# Altium project copper_suicide.PrjPCB (part 5 of 5)
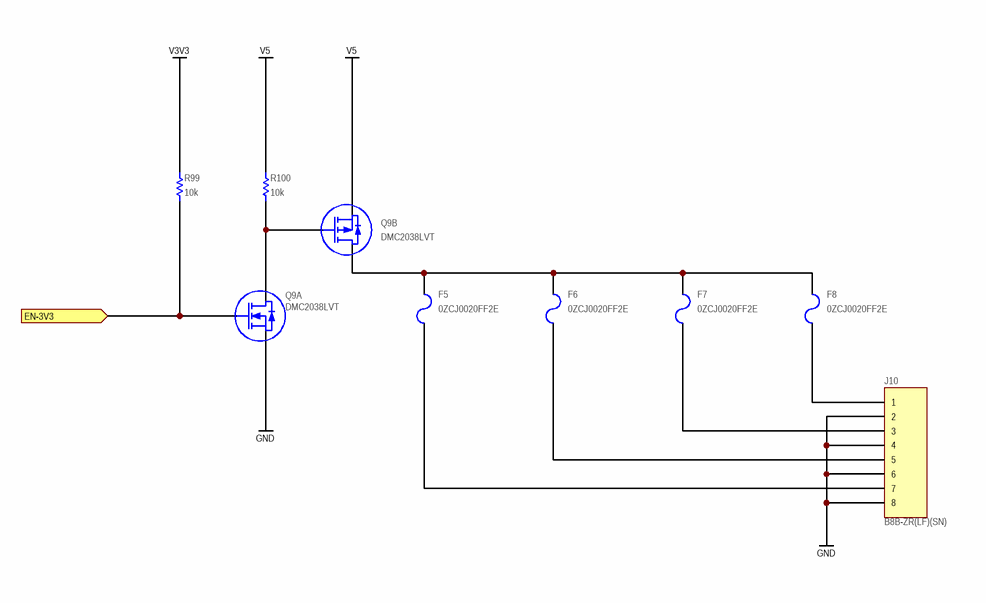
[diagram p22: fans.SchDoc]

## Nets that join several sheets
GND: array (J7.1 J7.4 J7.5), FPGA01 (46 pins), FPGA01/FPGAGND (226 pins), FPGA01/FPGASERDES (41 pins), FPGA01/FPGAPOWER (34 pins), FPGA02 (46 pins), FPGA02/FPGAGND (226 pins), FPGA02/FPGASERDES (41 pins), FPGA02/FPGAPOWER (34 pins), FPGA03 (46 pins), FPGA03/FPGAGND (226 pins), FPGA03/FPGASERDES (41 pins), FPGA03/FPGAPOWER (34 pins), FPGA30 (46 pins), FPGA30/FPGAGND (226 pins), FPGA30/FPGASERDES (41 pins), FPGA30/FPGAPOWER (34 pins), FPGA31 (46 pins), FPGA31/FPGAGND (226 pins), FPGA31/FPGASERDES (41 pins), FPGA31/FPGAPOWER (34 pins), FPGA32 (46 pins), FPGA32/FPGAGND (226 pins), FPGA32/FPGASERDES (41 pins), FPGA32/FPGAPOWER (34 pins), FPGA33 (46 pins), FPGA33/FPGAGND (226 pins), FPGA33/FPGASERDES (41 pins), FPGA33/FPGAPOWER (34 pins), FPGA10 (46 pins), FPGA10/FPGAGND (226 pins), FPGA10/FPGASERDES (41 pins), FPGA10/FPGAPOWER (34 pins), FPGA11 (46 pins), FPGA11/FPGAGND (226 pins), FPGA11/FPGASERDES (41 pins), FPGA11/FPGAPOWER (34 pins), FPGA12 (46 pins), FPGA12/FPGAGND (226 pins), FPGA12/FPGASERDES (41 pins), FPGA12/FPGAPOWER (34 pins), FPGA13 (46 pins), FPGA13/FPGAGND (226 pins), FPGA13/FPGASERDES (41 pins), FPGA13/FPGAPOWER (34 pins), FPGA20 (46 pins), FPGA20/FPGAGND (226 pins), FPGA20/FPGASERDES (41 pins), FPGA20/FPGAPOWER (34 pins), FPGA21 (46 pins), FPGA21/FPGAGND (226 pins), FPGA21/FPGASERDES (41 pins), FPGA21/FPGAPOWER (34 pins), FPGA22 (46 pins), FPGA22/FPGAGND (226 pins), FPGA22/FPGASERDES (41 pins), FPGA22/FPGAPOWER (34 pins), FPGA23 (46 pins), FPGA23/FPGAGND (226 pins), FPGA23/FPGASERDES (41 pins), FPGA23/FPGAPOWER (34 pins), clock (61 pins), CFG (46 pins), CFG/FPGAGND (226 pins), CFG/FPGASERDES (41 pins), CFG/FPGAPOWER (34 pins), FPGA00 (46 pins), FPGA00/FPGAGND (226 pins), FPGA00/FPGASERDES (41 pins), FPGA00/FPGAPOWER (34 pins), con-right-bot (160 pins), con-left-bot (160 pins), con-right-top (160 pins), con-left-top (160 pins), config (24 pins), flash (C154.1 C155.1 U17.B3), fans (5 pins)
V1V35: con-right-bot (R26.1 R27.1 R28.1), con-left-bot (R22.1 R23.1 R24.1), con-right-top (R80.1 R81.1 R82.1), con-left-top (R76.1 R77.1 R78.1)
V2V5: FPGA01/FPGAPOWER (12 pins), FPGA02/FPGAPOWER (12 pins), FPGA03/FPGAPOWER (12 pins), FPGA30/FPGAPOWER (12 pins), FPGA31/FPGAPOWER (12 pins), FPGA32/FPGAPOWER (12 pins), FPGA33/FPGAPOWER (12 pins), FPGA10/FPGAPOWER (12 pins), FPGA11/FPGAPOWER (12 pins), FPGA12/FPGAPOWER (12 pins), FPGA13/FPGAPOWER (12 pins), FPGA20/FPGAPOWER (12 pins), FPGA21/FPGAPOWER (12 pins), FPGA22/FPGAPOWER (12 pins), FPGA23/FPGAPOWER (12 pins), CFG/FPGAPOWER (12 pins), FPGA00/FPGAPOWER (12 pins)
V3V3: FPGA01 (9 pins), FPGA01/FPGAPOWER (5 pins), FPGA02 (9 pins), FPGA02/FPGAPOWER (5 pins), FPGA03 (9 pins), FPGA03/FPGAPOWER (5 pins), FPGA30 (9 pins), FPGA30/FPGAPOWER (5 pins), FPGA31 (9 pins), FPGA31/FPGAPOWER (5 pins), FPGA32 (9 pins), FPGA32/FPGAPOWER (5 pins), FPGA33 (9 pins), FPGA33/FPGAPOWER (5 pins), FPGA10 (9 pins), FPGA10/FPGAPOWER (5 pins), FPGA11 (9 pins), FPGA11/FPGAPOWER (5 pins), FPGA12 (9 pins), FPGA12/FPGAPOWER (5 pins), FPGA13 (9 pins), FPGA13/FPGAPOWER (5 pins), FPGA20 (9 pins), FPGA20/FPGAPOWER (5 pins), FPGA21 (9 pins), FPGA21/FPGAPOWER (5 pins), FPGA22 (9 pins), FPGA22/FPGAPOWER (5 pins), FPGA23 (9 pins), FPGA23/FPGAPOWER (5 pins), clock (L2.2 L3.2 U3.9), CFG (9 pins), CFG/FPGAPOWER (5 pins), FPGA00 (9 pins), FPGA00/FPGAPOWER (5 pins), config (12 pins), flash (9 pins), fans (R99.2)
V12: FPGA01/FPGAPOWER (C9A.2 U7A.10 U7A.11 U7A.12), FPGA02/FPGAPOWER (C9B.2 U7B.10 U7B.11 U7B.12), FPGA03/FPGAPOWER (C9C.2 U7C.10 U7C.11 U7C.12), FPGA30/FPGAPOWER (C9D.2 U7D.10 U7D.11 U7D.12), FPGA31/FPGAPOWER (C9E.2 U7E.10 U7E.11 U7E.12), FPGA32/FPGAPOWER (C9F.2 U7F.10 U7F.11 U7F.12), FPGA33/FPGAPOWER (C9G.2 U7G.10 U7G.11 U7G.12), FPGA10/FPGAPOWER (C9H.2 U7H.10 U7H.11 U7H.12), FPGA11/FPGAPOWER (C9I.2 U7I.10 U7I.11 U7I.12), FPGA12/FPGAPOWER (C9J.2 U7J.10 U7J.11 U7J.12), FPGA13/FPGAPOWER (C9K.2 U7K.10 U7K.11 U7K.12), FPGA20/FPGAPOWER (C9L.2 U7L.10 U7L.11 U7L.12), FPGA21/FPGAPOWER (C9M.2 U7M.10 U7M.11 U7M.12), FPGA22/FPGAPOWER (C9N.2 U7N.10 U7N.11 U7N.12), FPGA23/FPGAPOWER (C9O.2 U7O.10 U7O.11 U7O.12), CFG/FPGAPOWER (C9P.2 U7P.10 U7P.11 U7P.12), FPGA00/FPGAPOWER (C9Q.2 U7Q.10 U7Q.11 U7Q.12)
V48: con-right-bot (16 pins), con-right-top (16 pins)
VTTL: con-left-bot (R21.1), con-left-top (R75.1)
VTTR: con-right-bot (R25.1), con-right-top (R79.1)
CLK.C_N: FPGA01 (C7A.2), clock (R17.6 U3.28)
CLK.C_N: FPGA02 (C7B.2), clock (R17.8 U3.26)
CLK.C_N: FPGA03 (C7C.2), clock (R18.2 U3.24)
CLK.C_N: FPGA30 (C7D.2), clock (R13.4 U3.52)
CLK.C_N: FPGA31 (C7E.2), clock (R13.2 U3.54)
CLK.C_N: FPGA32 (C7F.2), clock (R12.8 U3.56)
CLK.C_N: FPGA33 (C7G.2), clock (R13.8 U3.46)
CLK.C_N: FPGA10 (C7H.2), clock (R17.2 U3.34)
CLK.C_N: FPGA11 (C7I.2), clock (R16.8 U3.36)
CLK.C_N: FPGA12 (C7J.2), clock (R16.6 U3.38)
CLK.C_N: FPGA13 (C7K.2), clock (R16.4 U3.42)
CLK.C_N: FPGA20 (C7L.2), clock (R12.6 U3.59)
CLK.C_N: FPGA21 (C7M.2), clock (R12.4 U3.61)
CLK.C_N: FPGA22 (C7N.2), clock (R12.2 U3.63)
CLK.C_N: FPGA23 (C7O.2), clock (R16.2 U3.44)
CLK.C_N: clock (R13.6 U3.50), CFG (C7P.2)
CLK.C_N: clock (R17.4 U3.30), FPGA00 (C7Q.2)
CLK.C_P: FPGA01 (C6A.2), clock (R17.5 U3.29)
CLK.C_P: FPGA02 (C6B.2), clock (R17.7 U3.27)
CLK.C_P: FPGA03 (C6C.2), clock (R18.1 U3.25)
CLK.C_P: FPGA30 (C6D.2), clock (R13.3 U3.53)
CLK.C_P: FPGA31 (C6E.2), clock (R13.1 U3.55)
CLK.C_P: FPGA32 (C6F.2), clock (R12.7 U3.57)
CLK.C_P: FPGA33 (C6G.2), clock (R13.7 U3.47)
CLK.C_P: FPGA10 (C6H.2), clock (R17.1 U3.35)
CLK.C_P: FPGA11 (C6I.2), clock (R16.7 U3.37)
CLK.C_P: FPGA12 (C6J.2), clock (R16.5 U3.39)
CLK.C_P: FPGA13 (C6K.2), clock (R16.3 U3.43)
CLK.C_P: FPGA20 (C6L.2), clock (R12.5 U3.60)
CLK.C_P: FPGA21 (C6M.2), clock (R12.3 U3.62)
CLK.C_P: FPGA22 (C6N.2), clock (R12.1 U3.64)
CLK.C_P: FPGA23 (C6O.2), clock (R16.1 U3.45)
CLK.C_P: clock (R13.5 U3.51), CFG (C6P.2)
CLK.C_P: clock (R17.3 U3.31), FPGA00 (C6Q.2)
CLK_SEL: array (J7.6), clock (U3.8 U4.1)
FPGA_LED_CFG: CFG (Q1P.1), CFG/FPGA0B (U1P#1.A8)
FPGA_LED_FPGA00: FPGA00 (Q1Q.1), FPGA00/FPGA0B (U1Q#1.A8)
FPGA_LED_FPGA01: FPGA01 (Q1A.1), FPGA01/FPGA0B (U1A#1.A8)
FPGA_LED_FPGA02: FPGA02 (Q1B.1), FPGA02/FPGA0B (U1B#1.A8)
FPGA_LED_FPGA03: FPGA03 (Q1C.1), FPGA03/FPGA0B (U1C#1.A8)
FPGA_LED_FPGA10: FPGA10 (Q1H.1), FPGA10/FPGA0B (U1H#1.A8)
FPGA_LED_FPGA11: FPGA11 (Q1I.1), FPGA11/FPGA0B (U1I#1.A8)
FPGA_LED_FPGA12: FPGA12 (Q1J.1), FPGA12/FPGA0B (U1J#1.A8)
FPGA_LED_FPGA13: FPGA13 (Q1K.1), FPGA13/FPGA0B (U1K#1.A8)
FPGA_LED_FPGA20: FPGA20 (Q1L.1), FPGA20/FPGA0B (U1L#1.A8)
FPGA_LED_FPGA21: FPGA21 (Q1M.1), FPGA21/FPGA0B (U1M#1.A8)
FPGA_LED_FPGA22: FPGA22 (Q1N.1), FPGA22/FPGA0B (U1N#1.A8)
FPGA_LED_FPGA23: FPGA23 (Q1O.1), FPGA23/FPGA0B (U1O#1.A8)
FPGA_LED_FPGA30: FPGA30 (Q1D.1), FPGA30/FPGA0B (U1D#1.A8)
FPGA_LED_FPGA31: FPGA31 (Q1E.1), FPGA31/FPGA0B (U1E#1.A8)
FPGA_LED_FPGA32: FPGA32 (Q1F.1), FPGA32/FPGA0B (U1F#1.A8)
FPGA_LED_FPGA33: FPGA33 (Q1G.1), FPGA33/FPGA0B (U1G#1.A8)
FPGA_TCK_CFG: CFG (U6P.10), CFG/FPGA8B (U1P#8.AK5)
FPGA_TCK_FPGA00: FPGA00 (U6Q.10), FPGA00/FPGA8B (U1Q#8.AK5)
FPGA_TCK_FPGA01: FPGA01 (U6A.10), FPGA01/FPGA8B (U1A#8.AK5)
FPGA_TCK_FPGA02: FPGA02 (U6B.10), FPGA02/FPGA8B (U1B#8.AK5)
FPGA_TCK_FPGA03: FPGA03 (U6C.10), FPGA03/FPGA8B (U1C#8.AK5)
FPGA_TCK_FPGA10: FPGA10 (U6H.10), FPGA10/FPGA8B (U1H#8.AK5)
FPGA_TCK_FPGA11: FPGA11 (U6I.10), FPGA11/FPGA8B (U1I#8.AK5)
FPGA_TCK_FPGA12: FPGA12 (U6J.10), FPGA12/FPGA8B (U1J#8.AK5)
FPGA_TCK_FPGA13: FPGA13 (U6K.10), FPGA13/FPGA8B (U1K#8.AK5)
FPGA_TCK_FPGA20: FPGA20 (U6L.10), FPGA20/FPGA8B (U1L#8.AK5)
FPGA_TCK_FPGA21: FPGA21 (U6M.10), FPGA21/FPGA8B (U1M#8.AK5)
FPGA_TCK_FPGA22: FPGA22 (U6N.10), FPGA22/FPGA8B (U1N#8.AK5)
FPGA_TCK_FPGA23: FPGA23 (U6O.10), FPGA23/FPGA8B (U1O#8.AK5)
FPGA_TCK_FPGA30: FPGA30 (U6D.10), FPGA30/FPGA8B (U1D#8.AK5)
FPGA_TCK_FPGA31: FPGA31 (U6E.10), FPGA31/FPGA8B (U1E#8.AK5)
FPGA_TCK_FPGA32: FPGA32 (U6F.10), FPGA32/FPGA8B (U1F#8.AK5)
FPGA_TCK_FPGA33: FPGA33 (U6G.10), FPGA33/FPGA8B (U1G#8.AK5)
FPGA_TDI_CFG: CFG (U6P.12), CFG/FPGA8B (U1P#8.AJ5)
FPGA_TDI_FPGA00: FPGA00 (U6Q.12), FPGA00/FPGA8B (U1Q#8.AJ5)
FPGA_TDI_FPGA01: FPGA01 (U6A.12), FPGA01/FPGA8B (U1A#8.AJ5)
FPGA_TDI_FPGA02: FPGA02 (U6B.12), FPGA02/FPGA8B (U1B#8.AJ5)
FPGA_TDI_FPGA03: FPGA03 (U6C.12), FPGA03/FPGA8B (U1C#8.AJ5)
FPGA_TDI_FPGA10: FPGA10 (U6H.12), FPGA10/FPGA8B (U1H#8.AJ5)
FPGA_TDI_FPGA11: FPGA11 (U6I.12), FPGA11/FPGA8B (U1I#8.AJ5)
FPGA_TDI_FPGA12: FPGA12 (U6J.12), FPGA12/FPGA8B (U1J#8.AJ5)
FPGA_TDI_FPGA13: FPGA13 (U6K.12), FPGA13/FPGA8B (U1K#8.AJ5)
FPGA_TDI_FPGA20: FPGA20 (U6L.12), FPGA20/FPGA8B (U1L#8.AJ5)
FPGA_TDI_FPGA21: FPGA21 (U6M.12), FPGA21/FPGA8B (U1M#8.AJ5)
FPGA_TDI_FPGA22: FPGA22 (U6N.12), FPGA22/FPGA8B (U1N#8.AJ5)
FPGA_TDI_FPGA23: FPGA23 (U6O.12), FPGA23/FPGA8B (U1O#8.AJ5)
FPGA_TDI_FPGA30: FPGA30 (U6D.12), FPGA30/FPGA8B (U1D#8.AJ5)
FPGA_TDI_FPGA31: FPGA31 (U6E.12), FPGA31/FPGA8B (U1E#8.AJ5)
FPGA_TDI_FPGA32: FPGA32 (U6F.12), FPGA32/FPGA8B (U1F#8.AJ5)
FPGA_TDI_FPGA33: FPGA33 (U6G.12), FPGA33/FPGA8B (U1G#8.AJ5)
FPGA_TDO_CFG: CFG (R4P.1 U6P.11), CFG/FPGA8B (U1P#8.AG5)
FPGA_TDO_FPGA00: FPGA00 (R4Q.1 U6Q.11), FPGA00/FPGA8B (U1Q#8.AG5)
FPGA_TDO_FPGA01: FPGA01 (R4A.1 U6A.11), FPGA01/FPGA8B (U1A#8.AG5)
FPGA_TDO_FPGA02: FPGA02 (R4B.1 U6B.11), FPGA02/FPGA8B (U1B#8.AG5)
FPGA_TDO_FPGA03: FPGA03 (R4C.1 U6C.11), FPGA03/FPGA8B (U1C#8.AG5)
FPGA_TDO_FPGA10: FPGA10 (R4H.1 U6H.11), FPGA10/FPGA8B (U1H#8.AG5)
FPGA_TDO_FPGA11: FPGA11 (R4I.1 U6I.11), FPGA11/FPGA8B (U1I#8.AG5)
FPGA_TDO_FPGA12: FPGA12 (R4J.1 U6J.11), FPGA12/FPGA8B (U1J#8.AG5)
FPGA_TDO_FPGA13: FPGA13 (R4K.1 U6K.11), FPGA13/FPGA8B (U1K#8.AG5)
FPGA_TDO_FPGA20: FPGA20 (R4L.1 U6L.11), FPGA20/FPGA8B (U1L#8.AG5)
FPGA_TDO_FPGA21: FPGA21 (R4M.1 U6M.11), FPGA21/FPGA8B (U1M#8.AG5)
FPGA_TDO_FPGA22: FPGA22 (R4N.1 U6N.11), FPGA22/FPGA8B (U1N#8.AG5)
FPGA_TDO_FPGA23: FPGA23 (R4O.1 U6O.11), FPGA23/FPGA8B (U1O#8.AG5)
FPGA_TDO_FPGA30: FPGA30 (R4D.1 U6D.11), FPGA30/FPGA8B (U1D#8.AG5)
FPGA_TDO_FPGA31: FPGA31 (R4E.1 U6E.11), FPGA31/FPGA8B (U1E#8.AG5)
FPGA_TDO_FPGA32: FPGA32 (R4F.1 U6F.11), FPGA32/FPGA8B (U1F#8.AG5)
FPGA_TDO_FPGA33: FPGA33 (R4G.1 U6G.11), FPGA33/FPGA8B (U1G#8.AG5)
FPGA_TMS_CFG: CFG (U6P.9), CFG/FPGA8B (U1P#8.AM5)
FPGA_TMS_FPGA00: FPGA00 (U6Q.9), FPGA00/FPGA8B (U1Q#8.AM5)
FPGA_TMS_FPGA01: FPGA01 (U6A.9), FPGA01/FPGA8B (U1A#8.AM5)
FPGA_TMS_FPGA02: FPGA02 (U6B.9), FPGA02/FPGA8B (U1B#8.AM5)
FPGA_TMS_FPGA03: FPGA03 (U6C.9), FPGA03/FPGA8B (U1C#8.AM5)
FPGA_TMS_FPGA10: FPGA10 (U6H.9), FPGA10/FPGA8B (U1H#8.AM5)
FPGA_TMS_FPGA11: FPGA11 (U6I.9), FPGA11/FPGA8B (U1I#8.AM5)
FPGA_TMS_FPGA12: FPGA12 (U6J.9), FPGA12/FPGA8B (U1J#8.AM5)
FPGA_TMS_FPGA13: FPGA13 (U6K.9), FPGA13/FPGA8B (U1K#8.AM5)
FPGA_TMS_FPGA20: FPGA20 (U6L.9), FPGA20/FPGA8B (U1L#8.AM5)
FPGA_TMS_FPGA21: FPGA21 (U6M.9), FPGA21/FPGA8B (U1M#8.AM5)
FPGA_TMS_FPGA22: FPGA22 (U6N.9), FPGA22/FPGA8B (U1N#8.AM5)
FPGA_TMS_FPGA23: FPGA23 (U6O.9), FPGA23/FPGA8B (U1O#8.AM5)
FPGA_TMS_FPGA30: FPGA30 (U6D.9), FPGA30/FPGA8B (U1D#8.AM5)
FPGA_TMS_FPGA31: FPGA31 (U6E.9), FPGA31/FPGA8B (U1E#8.AM5)
FPGA_TMS_FPGA32: FPGA32 (U6F.9), FPGA32/FPGA8B (U1F#8.AM5)
FPGA_TMS_FPGA33: FPGA33 (U6G.9), FPGA33/FPGA8B (U1G#8.AM5)
I2C.SCL: FPGA01/FPGAPOWER (U5A.7), FPGA02/FPGAPOWER (U5B.7), FPGA03/FPGAPOWER (U5C.7), FPGA10/FPGAPOWER (U5H.7), FPGA11/FPGAPOWER (U5I.7), FPGA12/FPGAPOWER (U5J.7), FPGA13/FPGAPOWER (U5K.7), FPGA00/FPGAPOWER (U5Q.7)
I2C.SCL: FPGA30/FPGAPOWER (U5D.7), FPGA31/FPGAPOWER (U5E.7), FPGA32/FPGAPOWER (U5F.7), FPGA33/FPGAPOWER (U5G.7), FPGA20/FPGAPOWER (U5L.7), FPGA21/FPGAPOWER (U5M.7), FPGA22/FPGAPOWER (U5N.7), FPGA23/FPGAPOWER (U5O.7)
I2C.SDA: FPGA01/FPGAPOWER (U5A.6), FPGA02/FPGAPOWER (U5B.6), FPGA03/FPGAPOWER (U5C.6), FPGA10/FPGAPOWER (U5H.6), FPGA11/FPGAPOWER (U5I.6), FPGA12/FPGAPOWER (U5J.6), FPGA13/FPGAPOWER (U5K.6), FPGA00/FPGAPOWER (U5Q.6)
I2C.SDA: FPGA30/FPGAPOWER (U5D.6), FPGA31/FPGAPOWER (U5E.6), FPGA32/FPGAPOWER (U5F.6), FPGA33/FPGAPOWER (U5G.6), FPGA20/FPGAPOWER (U5L.6), FPGA21/FPGAPOWER (U5M.6), FPGA22/FPGAPOWER (U5N.6), FPGA23/FPGAPOWER (U5O.6)
IL07.VIOLR_CFG: CFG (C15P.2 C16P.2 C17P.2 C18P.2), CFG/FPGA7B (U1P#7.M10 U1P#7.P10 U1P#7.R10 U1P#7.T10)
IL07.VIOLR_FPGA00: FPGA00 (C15Q.2 C16Q.2 C17Q.2 C18Q.2), FPGA00/FPGA7B (U1Q#7.M10 U1Q#7.P10 U1Q#7.R10 U1Q#7.T10)
IL07.VIOLR_FPGA01: FPGA01 (C15A.2 C16A.2 C17A.2 C18A.2), FPGA01/FPGA7B (U1A#7.M10 U1A#7.P10 U1A#7.R10 U1A#7.T10)
IL07.VIOLR_FPGA02: FPGA02 (C15B.2 C16B.2 C17B.2 C18B.2), FPGA02/FPGA7B (U1B#7.M10 U1B#7.P10 U1B#7.R10 U1B#7.T10)
IL07.VIOLR_FPGA03: FPGA03 (C15C.2 C16C.2 C17C.2 C18C.2), FPGA03/FPGA7B (U1C#7.M10 U1C#7.P10 U1C#7.R10 U1C#7.T10)
IL07.VIOLR_FPGA10: FPGA10 (C15H.2 C16H.2 C17H.2 C18H.2), FPGA10/FPGA7B (U1H#7.M10 U1H#7.P10 U1H#7.R10 U1H#7.T10)
IL07.VIOLR_FPGA11: FPGA11 (C15I.2 C16I.2 C17I.2 C18I.2), FPGA11/FPGA7B (U1I#7.M10 U1I#7.P10 U1I#7.R10 U1I#7.T10)
IL07.VIOLR_FPGA12: FPGA12 (C15J.2 C16J.2 C17J.2 C18J.2), FPGA12/FPGA7B (U1J#7.M10 U1J#7.P10 U1J#7.R10 U1J#7.T10)
IL07.VIOLR_FPGA13: FPGA13 (C15K.2 C16K.2 C17K.2 C18K.2), FPGA13/FPGA7B (U1K#7.M10 U1K#7.P10 U1K#7.R10 U1K#7.T10)
IL07.VIOLR_FPGA20: FPGA20 (C15L.2 C16L.2 C17L.2 C18L.2), FPGA20/FPGA7B (U1L#7.M10 U1L#7.P10 U1L#7.R10 U1L#7.T10)
IL07.VIOLR_FPGA21: FPGA21 (C15M.2 C16M.2 C17M.2 C18M.2), FPGA21/FPGA7B (U1M#7.M10 U1M#7.P10 U1M#7.R10 U1M#7.T10)
IL07.VIOLR_FPGA22: FPGA22 (C15N.2 C16N.2 C17N.2 C18N.2), FPGA22/FPGA7B (U1N#7.M10 U1N#7.P10 U1N#7.R10 U1N#7.T10)
IL07.VIOLR_FPGA23: FPGA23 (C15O.2 C16O.2 C17O.2 C18O.2), FPGA23/FPGA7B (U1O#7.M10 U1O#7.P10 U1O#7.R10 U1O#7.T10)
IL07.VIOLR_FPGA30: FPGA30 (C15D.2 C16D.2 C17D.2 C18D.2), FPGA30/FPGA7B (U1D#7.M10 U1D#7.P10 U1D#7.R10 U1D#7.T10)
IL07.VIOLR_FPGA31: FPGA31 (C15E.2 C16E.2 C17E.2 C18E.2), FPGA31/FPGA7B (U1E#7.M10 U1E#7.P10 U1E#7.R10 U1E#7.T10)
IL07.VIOLR_FPGA32: FPGA32 (C15F.2 C16F.2 C17F.2 C18F.2), FPGA32/FPGA7B (U1F#7.M10 U1F#7.P10 U1F#7.R10 U1F#7.T10)
IL07.VIOLR_FPGA33: FPGA33 (C15G.2 C16G.2 C17G.2 C18G.2), FPGA33/FPGA7B (U1G#7.M10 U1G#7.P10 U1G#7.R10 U1G#7.T10)
IL07.VIOTB_CFG: CFG (C46P.2 C47P.2 C48P.2 C49P.2), CFG/FPGA0B (U1P#1.K12 U1P#1.K14 U1P#1.K15 U1P#1.K16)
IL07.VIOTB_FPGA00: FPGA00 (C46Q.2 C47Q.2 C48Q.2 C49Q.2), FPGA00/FPGA0B (U1Q#1.K12 U1Q#1.K14 U1Q#1.K15 U1Q#1.K16)
IL07.VIOTB_FPGA01: FPGA01 (C46A.2 C47A.2 C48A.2 C49A.2), FPGA01/FPGA0B (U1A#1.K12 U1A#1.K14 U1A#1.K15 U1A#1.K16)
IL07.VIOTB_FPGA02: FPGA02 (C46B.2 C47B.2 C48B.2 C49B.2), FPGA02/FPGA0B (U1B#1.K12 U1B#1.K14 U1B#1.K15 U1B#1.K16)
IL07.VIOTB_FPGA03: FPGA03 (C46C.2 C47C.2 C48C.2 C49C.2), FPGA03/FPGA0B (U1C#1.K12 U1C#1.K14 U1C#1.K15 U1C#1.K16)
IL07.VIOTB_FPGA10: FPGA10 (C46H.2 C47H.2 C48H.2 C49H.2), FPGA10/FPGA0B (U1H#1.K12 U1H#1.K14 U1H#1.K15 U1H#1.K16)
IL07.VIOTB_FPGA11: FPGA11 (C46I.2 C47I.2 C48I.2 C49I.2), FPGA11/FPGA0B (U1I#1.K12 U1I#1.K14 U1I#1.K15 U1I#1.K16)
IL07.VIOTB_FPGA12: FPGA12 (C46J.2 C47J.2 C48J.2 C49J.2), FPGA12/FPGA0B (U1J#1.K12 U1J#1.K14 U1J#1.K15 U1J#1.K16)
IL07.VIOTB_FPGA13: FPGA13 (C46K.2 C47K.2 C48K.2 C49K.2), FPGA13/FPGA0B (U1K#1.K12 U1K#1.K14 U1K#1.K15 U1K#1.K16)
IL07.VIOTB_FPGA20: FPGA20 (C46L.2 C47L.2 C48L.2 C49L.2), FPGA20/FPGA0B (U1L#1.K12 U1L#1.K14 U1L#1.K15 U1L#1.K16)
IL07.VIOTB_FPGA21: FPGA21 (C46M.2 C47M.2 C48M.2 C49M.2), FPGA21/FPGA0B (U1M#1.K12 U1M#1.K14 U1M#1.K15 U1M#1.K16)
IL07.VIOTB_FPGA22: FPGA22 (C46N.2 C47N.2 C48N.2 C49N.2), FPGA22/FPGA0B (U1N#1.K12 U1N#1.K14 U1N#1.K15 U1N#1.K16)
IL07.VIOTB_FPGA23: FPGA23 (C46O.2 C47O.2 C48O.2 C49O.2), FPGA23/FPGA0B (U1O#1.K12 U1O#1.K14 U1O#1.K15 U1O#1.K16)
IL07.VIOTB_FPGA30: FPGA30 (C46D.2 C47D.2 C48D.2 C49D.2), FPGA30/FPGA0B (U1D#1.K12 U1D#1.K14 U1D#1.K15 U1D#1.K16)
IL07.VIOTB_FPGA31: FPGA31 (C46E.2 C47E.2 C48E.2 C49E.2), FPGA31/FPGA0B (U1E#1.K12 U1E#1.K14 U1E#1.K15 U1E#1.K16)
IL07.VIOTB_FPGA32: FPGA32 (C46F.2 C47F.2 C48F.2 C49F.2), FPGA32/FPGA0B (U1F#1.K12 U1F#1.K14 U1F#1.K15 U1F#1.K16)
IL07.VIOTB_FPGA33: FPGA33 (C46G.2 C47G.2 C48G.2 C49G.2), FPGA33/FPGA0B (U1G#1.K12 U1G#1.K14 U1G#1.K15 U1G#1.K16)
IL12.VIOLR_CFG: CFG (C54P.2 C55P.2 C56P.2 C57P.2), CFG/FPGA2B (U1P#3.M23 U1P#3.P23 U1P#3.R23 U1P#3.T23)
IL12.VIOLR_FPGA00: FPGA00 (C54Q.2 C55Q.2 C56Q.2 C57Q.2), FPGA00/FPGA2B (U1Q#3.M23 U1Q#3.P23 U1Q#3.R23 U1Q#3.T23)
IL12.VIOLR_FPGA01: FPGA01 (C54A.2 C55A.2 C56A.2 C57A.2), FPGA01/FPGA2B (U1A#3.M23 U1A#3.P23 U1A#3.R23 U1A#3.T23)
IL12.VIOLR_FPGA02: FPGA02 (C54B.2 C55B.2 C56B.2 C57B.2), FPGA02/FPGA2B (U1B#3.M23 U1B#3.P23 U1B#3.R23 U1B#3.T23)
IL12.VIOLR_FPGA03: FPGA03 (C54C.2 C55C.2 C56C.2 C57C.2), FPGA03/FPGA2B (U1C#3.M23 U1C#3.P23 U1C#3.R23 U1C#3.T23)
IL12.VIOLR_FPGA10: FPGA10 (C54H.2 C55H.2 C56H.2 C57H.2), FPGA10/FPGA2B (U1H#3.M23 U1H#3.P23 U1H#3.R23 U1H#3.T23)
IL12.VIOLR_FPGA11: FPGA11 (C54I.2 C55I.2 C56I.2 C57I.2), FPGA11/FPGA2B (U1I#3.M23 U1I#3.P23 U1I#3.R23 U1I#3.T23)
IL12.VIOLR_FPGA12: FPGA12 (C54J.2 C55J.2 C56J.2 C57J.2), FPGA12/FPGA2B (U1J#3.M23 U1J#3.P23 U1J#3.R23 U1J#3.T23)
IL12.VIOLR_FPGA13: FPGA13 (C54K.2 C55K.2 C56K.2 C57K.2), FPGA13/FPGA2B (U1K#3.M23 U1K#3.P23 U1K#3.R23 U1K#3.T23)
IL12.VIOLR_FPGA20: FPGA20 (C54L.2 C55L.2 C56L.2 C57L.2), FPGA20/FPGA2B (U1L#3.M23 U1L#3.P23 U1L#3.R23 U1L#3.T23)
IL12.VIOLR_FPGA21: FPGA21 (C54M.2 C55M.2 C56M.2 C57M.2), FPGA21/FPGA2B (U1M#3.M23 U1M#3.P23 U1M#3.R23 U1M#3.T23)
IL12.VIOLR_FPGA22: FPGA22 (C54N.2 C55N.2 C56N.2 C57N.2), FPGA22/FPGA2B (U1N#3.M23 U1N#3.P23 U1N#3.R23 U1N#3.T23)
IL12.VIOLR_FPGA23: FPGA23 (C54O.2 C55O.2 C56O.2 C57O.2), FPGA23/FPGA2B (U1O#3.M23 U1O#3.P23 U1O#3.R23 U1O#3.T23)
IL12.VIOLR_FPGA30: FPGA30 (C54D.2 C55D.2 C56D.2 C57D.2), FPGA30/FPGA2B (U1D#3.M23 U1D#3.P23 U1D#3.R23 U1D#3.T23)
IL12.VIOLR_FPGA31: FPGA31 (C54E.2 C55E.2 C56E.2 C57E.2), FPGA31/FPGA2B (U1E#3.M23 U1E#3.P23 U1E#3.R23 U1E#3.T23)
IL12.VIOLR_FPGA32: FPGA32 (C54F.2 C55F.2 C56F.2 C57F.2), FPGA32/FPGA2B (U1F#3.M23 U1F#3.P23 U1F#3.R23 U1F#3.T23)
IL12.VIOLR_FPGA33: FPGA33 (C54G.2 C55G.2 C56G.2 C57G.2), FPGA33/FPGA2B (U1G#3.M23 U1G#3.P23 U1G#3.R23 U1G#3.T23)
IL12.VIOTB_CFG: CFG (C50P.2 C51P.2 C52P.2 C53P.2), CFG/FPGA1B (U1P#2.K17 U1P#2.K18 U1P#2.K19 U1P#2.K21)
IL12.VIOTB_FPGA00: FPGA00 (C50Q.2 C51Q.2 C52Q.2 C53Q.2), FPGA00/FPGA1B (U1Q#2.K17 U1Q#2.K18 U1Q#2.K19 U1Q#2.K21)
IL12.VIOTB_FPGA01: FPGA01 (C50A.2 C51A.2 C52A.2 C53A.2), FPGA01/FPGA1B (U1A#2.K17 U1A#2.K18 U1A#2.K19 U1A#2.K21)
IL12.VIOTB_FPGA02: FPGA02 (C50B.2 C51B.2 C52B.2 C53B.2), FPGA02/FPGA1B (U1B#2.K17 U1B#2.K18 U1B#2.K19 U1B#2.K21)
IL12.VIOTB_FPGA03: FPGA03 (C50C.2 C51C.2 C52C.2 C53C.2), FPGA03/FPGA1B (U1C#2.K17 U1C#2.K18 U1C#2.K19 U1C#2.K21)
IL12.VIOTB_FPGA10: FPGA10 (C50H.2 C51H.2 C52H.2 C53H.2), FPGA10/FPGA1B (U1H#2.K17 U1H#2.K18 U1H#2.K19 U1H#2.K21)
IL12.VIOTB_FPGA11: FPGA11 (C50I.2 C51I.2 C52I.2 C53I.2), FPGA11/FPGA1B (U1I#2.K17 U1I#2.K18 U1I#2.K19 U1I#2.K21)
IL12.VIOTB_FPGA12: FPGA12 (C50J.2 C51J.2 C52J.2 C53J.2), FPGA12/FPGA1B (U1J#2.K17 U1J#2.K18 U1J#2.K19 U1J#2.K21)
IL12.VIOTB_FPGA13: FPGA13 (C50K.2 C51K.2 C52K.2 C53K.2), FPGA13/FPGA1B (U1K#2.K17 U1K#2.K18 U1K#2.K19 U1K#2.K21)
IL12.VIOTB_FPGA20: FPGA20 (C50L.2 C51L.2 C52L.2 C53L.2), FPGA20/FPGA1B (U1L#2.K17 U1L#2.K18 U1L#2.K19 U1L#2.K21)
IL12.VIOTB_FPGA21: FPGA21 (C50M.2 C51M.2 C52M.2 C53M.2), FPGA21/FPGA1B (U1M#2.K17 U1M#2.K18 U1M#2.K19 U1M#2.K21)
IL12.VIOTB_FPGA22: FPGA22 (C50N.2 C51N.2 C52N.2 C53N.2), FPGA22/FPGA1B (U1N#2.K17 U1N#2.K18 U1N#2.K19 U1N#2.K21)
IL12.VIOTB_FPGA23: FPGA23 (C50O.2 C51O.2 C52O.2 C53O.2), FPGA23/FPGA1B (U1O#2.K17 U1O#2.K18 U1O#2.K19 U1O#2.K21)
IL12.VIOTB_FPGA30: FPGA30 (C50D.2 C51D.2 C52D.2 C53D.2), FPGA30/FPGA1B (U1D#2.K17 U1D#2.K18 U1D#2.K19 U1D#2.K21)
IL12.VIOTB_FPGA31: FPGA31 (C50E.2 C51E.2 C52E.2 C53E.2), FPGA31/FPGA1B (U1E#2.K17 U1E#2.K18 U1E#2.K19 U1E#2.K21)
IL12.VIOTB_FPGA32: FPGA32 (C50F.2 C51F.2 C52F.2 C53F.2), FPGA32/FPGA1B (U1F#2.K17 U1F#2.K18 U1F#2.K19 U1F#2.K21)
IL12.VIOTB_FPGA33: FPGA33 (C50G.2 C51G.2 C52G.2 C53G.2), FPGA33/FPGA1B (U1G#2.K17 U1G#2.K18 U1G#2.K19 U1G#2.K21)
IL34.VIOLR_CFG: CFG (C22P.2 C23P.2 C24P.2 C25P.2), CFG/FPGA3B (U1P#4.AA23 U1P#4.U23 U1P#4.V23 U1P#4.W23)
IL34.VIOLR_FPGA00: FPGA00 (C22Q.2 C23Q.2 C24Q.2 C25Q.2), FPGA00/FPGA3B (U1Q#4.AA23 U1Q#4.U23 U1Q#4.V23 U1Q#4.W23)
IL34.VIOLR_FPGA01: FPGA01 (C22A.2 C23A.2 C24A.2 C25A.2), FPGA01/FPGA3B (U1A#4.AA23 U1A#4.U23 U1A#4.V23 U1A#4.W23)
IL34.VIOLR_FPGA02: FPGA02 (C22B.2 C23B.2 C24B.2 C25B.2), FPGA02/FPGA3B (U1B#4.AA23 U1B#4.U23 U1B#4.V23 U1B#4.W23)
IL34.VIOLR_FPGA03: FPGA03 (C22C.2 C23C.2 C24C.2 C25C.2), FPGA03/FPGA3B (U1C#4.AA23 U1C#4.U23 U1C#4.V23 U1C#4.W23)
IL34.VIOLR_FPGA10: FPGA10 (C22H.2 C23H.2 C24H.2 C25H.2), FPGA10/FPGA3B (U1H#4.AA23 U1H#4.U23 U1H#4.V23 U1H#4.W23)
IL34.VIOLR_FPGA11: FPGA11 (C22I.2 C23I.2 C24I.2 C25I.2), FPGA11/FPGA3B (U1I#4.AA23 U1I#4.U23 U1I#4.V23 U1I#4.W23)
IL34.VIOLR_FPGA12: FPGA12 (C22J.2 C23J.2 C24J.2 C25J.2), FPGA12/FPGA3B (U1J#4.AA23 U1J#4.U23 U1J#4.V23 U1J#4.W23)
IL34.VIOLR_FPGA13: FPGA13 (C22K.2 C23K.2 C24K.2 C25K.2), FPGA13/FPGA3B (U1K#4.AA23 U1K#4.U23 U1K#4.V23 U1K#4.W23)
IL34.VIOLR_FPGA20: FPGA20 (C22L.2 C23L.2 C24L.2 C25L.2), FPGA20/FPGA3B (U1L#4.AA23 U1L#4.U23 U1L#4.V23 U1L#4.W23)
IL34.VIOLR_FPGA21: FPGA21 (C22M.2 C23M.2 C24M.2 C25M.2), FPGA21/FPGA3B (U1M#4.AA23 U1M#4.U23 U1M#4.V23 U1M#4.W23)
IL34.VIOLR_FPGA22: FPGA22 (C22N.2 C23N.2 C24N.2 C25N.2), FPGA22/FPGA3B (U1N#4.AA23 U1N#4.U23 U1N#4.V23 U1N#4.W23)
IL34.VIOLR_FPGA23: FPGA23 (C22O.2 C23O.2 C24O.2 C25O.2), FPGA23/FPGA3B (U1O#4.AA23 U1O#4.U23 U1O#4.V23 U1O#4.W23)
IL34.VIOLR_FPGA30: FPGA30 (C22D.2 C23D.2 C24D.2 C25D.2), FPGA30/FPGA3B (U1D#4.AA23 U1D#4.U23 U1D#4.V23 U1D#4.W23)
IL34.VIOLR_FPGA31: FPGA31 (C22E.2 C23E.2 C24E.2 C25E.2), FPGA31/FPGA3B (U1E#4.AA23 U1E#4.U23 U1E#4.V23 U1E#4.W23)
IL34.VIOLR_FPGA32: FPGA32 (C22F.2 C23F.2 C24F.2 C25F.2), FPGA32/FPGA3B (U1F#4.AA23 U1F#4.U23 U1F#4.V23 U1F#4.W23)
IL34.VIOLR_FPGA33: FPGA33 (C22G.2 C23G.2 C24G.2 C25G.2), FPGA33/FPGA3B (U1G#4.AA23 U1G#4.U23 U1G#4.V23 U1G#4.W23)
IL34.VIOTB_CFG: CFG (C28P.2 C29P.2 C30P.2), CFG/FPGA4B (U1P#5.AB23 U1P#5.AC23)
IL34.VIOTB_FPGA00: FPGA00 (C28Q.2 C29Q.2 C30Q.2), FPGA00/FPGA4B (U1Q#5.AB23 U1Q#5.AC23)
IL34.VIOTB_FPGA01: FPGA01 (C28A.2 C29A.2 C30A.2), FPGA01/FPGA4B (U1A#5.AB23 U1A#5.AC23)
IL34.VIOTB_FPGA02: FPGA02 (C28B.2 C29B.2 C30B.2), FPGA02/FPGA4B (U1B#5.AB23 U1B#5.AC23)
IL34.VIOTB_FPGA03: FPGA03 (C28C.2 C29C.2 C30C.2), FPGA03/FPGA4B (U1C#5.AB23 U1C#5.AC23)
IL34.VIOTB_FPGA10: FPGA10 (C28H.2 C29H.2 C30H.2), FPGA10/FPGA4B (U1H#5.AB23 U1H#5.AC23)
IL34.VIOTB_FPGA11: FPGA11 (C28I.2 C29I.2 C30I.2), FPGA11/FPGA4B (U1I#5.AB23 U1I#5.AC23)
IL34.VIOTB_FPGA12: FPGA12 (C28J.2 C29J.2 C30J.2), FPGA12/FPGA4B (U1J#5.AB23 U1J#5.AC23)
IL34.VIOTB_FPGA13: FPGA13 (C28K.2 C29K.2 C30K.2), FPGA13/FPGA4B (U1K#5.AB23 U1K#5.AC23)
IL34.VIOTB_FPGA20: FPGA20 (C28L.2 C29L.2 C30L.2), FPGA20/FPGA4B (U1L#5.AB23 U1L#5.AC23)
IL34.VIOTB_FPGA21: FPGA21 (C28M.2 C29M.2 C30M.2), FPGA21/FPGA4B (U1M#5.AB23 U1M#5.AC23)
IL34.VIOTB_FPGA22: FPGA22 (C28N.2 C29N.2 C30N.2), FPGA22/FPGA4B (U1N#5.AB23 U1N#5.AC23)
IL34.VIOTB_FPGA23: FPGA23 (C28O.2 C29O.2 C30O.2), FPGA23/FPGA4B (U1O#5.AB23 U1O#5.AC23)
IL34.VIOTB_FPGA30: FPGA30 (C28D.2 C29D.2 C30D.2), FPGA30/FPGA4B (U1D#5.AB23 U1D#5.AC23)
IL34.VIOTB_FPGA31: FPGA31 (C28E.2 C29E.2 C30E.2), FPGA31/FPGA4B (U1E#5.AB23 U1E#5.AC23)
IL34.VIOTB_FPGA32: FPGA32 (C28F.2 C29F.2 C30F.2), FPGA32/FPGA4B (U1F#5.AB23 U1F#5.AC23)
IL34.VIOTB_FPGA33: FPGA33 (C28G.2 C29G.2 C30G.2), FPGA33/FPGA4B (U1G#5.AB23 U1G#5.AC23)
IL68.VIOLR_CFG: CFG (C33P.2 C34P.2 C35P.2 C36P.2), CFG/FPGA6B (U1P#6.AA10 U1P#6.U10 U1P#6.V10 U1P#6.W10)
IL68.VIOLR_FPGA00: FPGA00 (C33Q.2 C34Q.2 C35Q.2 C36Q.2), FPGA00/FPGA6B (U1Q#6.AA10 U1Q#6.U10 U1Q#6.V10 U1Q#6.W10)
IL68.VIOLR_FPGA01: FPGA01 (C33A.2 C34A.2 C35A.2 C36A.2), FPGA01/FPGA6B (U1A#6.AA10 U1A#6.U10 U1A#6.V10 U1A#6.W10)
IL68.VIOLR_FPGA02: FPGA02 (C33B.2 C34B.2 C35B.2 C36B.2), FPGA02/FPGA6B (U1B#6.AA10 U1B#6.U10 U1B#6.V10 U1B#6.W10)
IL68.VIOLR_FPGA03: FPGA03 (C33C.2 C34C.2 C35C.2 C36C.2), FPGA03/FPGA6B (U1C#6.AA10 U1C#6.U10 U1C#6.V10 U1C#6.W10)
IL68.VIOLR_FPGA10: FPGA10 (C33H.2 C34H.2 C35H.2 C36H.2), FPGA10/FPGA6B (U1H#6.AA10 U1H#6.U10 U1H#6.V10 U1H#6.W10)
IL68.VIOLR_FPGA11: FPGA11 (C33I.2 C34I.2 C35I.2 C36I.2), FPGA11/FPGA6B (U1I#6.AA10 U1I#6.U10 U1I#6.V10 U1I#6.W10)
IL68.VIOLR_FPGA12: FPGA12 (C33J.2 C34J.2 C35J.2 C36J.2), FPGA12/FPGA6B (U1J#6.AA10 U1J#6.U10 U1J#6.V10 U1J#6.W10)
IL68.VIOLR_FPGA13: FPGA13 (C33K.2 C34K.2 C35K.2 C36K.2), FPGA13/FPGA6B (U1K#6.AA10 U1K#6.U10 U1K#6.V10 U1K#6.W10)
IL68.VIOLR_FPGA20: FPGA20 (C33L.2 C34L.2 C35L.2 C36L.2), FPGA20/FPGA6B (U1L#6.AA10 U1L#6.U10 U1L#6.V10 U1L#6.W10)
IL68.VIOLR_FPGA21: FPGA21 (C33M.2 C34M.2 C35M.2 C36M.2), FPGA21/FPGA6B (U1M#6.AA10 U1M#6.U10 U1M#6.V10 U1M#6.W10)
IL68.VIOLR_FPGA22: FPGA22 (C33N.2 C34N.2 C35N.2 C36N.2), FPGA22/FPGA6B (U1N#6.AA10 U1N#6.U10 U1N#6.V10 U1N#6.W10)
IL68.VIOLR_FPGA23: FPGA23 (C33O.2 C34O.2 C35O.2 C36O.2), FPGA23/FPGA6B (U1O#6.AA10 U1O#6.U10 U1O#6.V10 U1O#6.W10)
IL68.VIOLR_FPGA30: FPGA30 (C33D.2 C34D.2 C35D.2 C36D.2), FPGA30/FPGA6B (U1D#6.AA10 U1D#6.U10 U1D#6.V10 U1D#6.W10)
IL68.VIOLR_FPGA31: FPGA31 (C33E.2 C34E.2 C35E.2 C36E.2), FPGA31/FPGA6B (U1E#6.AA10 U1E#6.U10 U1E#6.V10 U1E#6.W10)
IL68.VIOLR_FPGA32: FPGA32 (C33F.2 C34F.2 C35F.2 C36F.2), FPGA32/FPGA6B (U1F#6.AA10 U1F#6.U10 U1F#6.V10 U1F#6.W10)
IL68.VIOLR_FPGA33: FPGA33 (C33G.2 C34G.2 C35G.2 C36G.2), FPGA33/FPGA6B (U1G#6.AA10 U1G#6.U10 U1G#6.V10 U1G#6.W10)
IL68.VIOTB_CFG: CFG (C31P.2 C32P.2 R4P.2 U6P.13), CFG/FPGA8B (R1P.2 U1P#8.AB10 U1P#8.AC10)
IL68.VIOTB_FPGA00: FPGA00 (C31Q.2 C32Q.2 R4Q.2 U6Q.13), FPGA00/FPGA8B (R1Q.2 U1Q#8.AB10 U1Q#8.AC10)
IL68.VIOTB_FPGA01: FPGA01 (C31A.2 C32A.2 R4A.2 U6A.13), FPGA01/FPGA8B (R1A.2 U1A#8.AB10 U1A#8.AC10)
IL68.VIOTB_FPGA02: FPGA02 (C31B.2 C32B.2 R4B.2 U6B.13), FPGA02/FPGA8B (R1B.2 U1B#8.AB10 U1B#8.AC10)
IL68.VIOTB_FPGA03: FPGA03 (C31C.2 C32C.2 R4C.2 U6C.13), FPGA03/FPGA8B (R1C.2 U1C#8.AB10 U1C#8.AC10)
IL68.VIOTB_FPGA10: FPGA10 (C31H.2 C32H.2 R4H.2 U6H.13), FPGA10/FPGA8B (R1H.2 U1H#8.AB10 U1H#8.AC10)
IL68.VIOTB_FPGA11: FPGA11 (C31I.2 C32I.2 R4I.2 U6I.13), FPGA11/FPGA8B (R1I.2 U1I#8.AB10 U1I#8.AC10)
IL68.VIOTB_FPGA12: FPGA12 (C31J.2 C32J.2 R4J.2 U6J.13), FPGA12/FPGA8B (R1J.2 U1J#8.AB10 U1J#8.AC10)
IL68.VIOTB_FPGA13: FPGA13 (C31K.2 C32K.2 R4K.2 U6K.13), FPGA13/FPGA8B (R1K.2 U1K#8.AB10 U1K#8.AC10)
IL68.VIOTB_FPGA20: FPGA20 (C31L.2 C32L.2 R4L.2 U6L.13), FPGA20/FPGA8B (R1L.2 U1L#8.AB10 U1L#8.AC10)
IL68.VIOTB_FPGA21: FPGA21 (C31M.2 C32M.2 R4M.2 U6M.13), FPGA21/FPGA8B (R1M.2 U1M#8.AB10 U1M#8.AC10)
IL68.VIOTB_FPGA22: FPGA22 (C31N.2 C32N.2 R4N.2 U6N.13), FPGA22/FPGA8B (R1N.2 U1N#8.AB10 U1N#8.AC10)
IL68.VIOTB_FPGA23: FPGA23 (C31O.2 C32O.2 R4O.2 U6O.13), FPGA23/FPGA8B (R1O.2 U1O#8.AB10 U1O#8.AC10)
IL68.VIOTB_FPGA30: FPGA30 (C31D.2 C32D.2 R4D.2 U6D.13), FPGA30/FPGA8B (R1D.2 U1D#8.AB10 U1D#8.AC10)
IL68.VIOTB_FPGA31: FPGA31 (C31E.2 C32E.2 R4E.2 U6E.13), FPGA31/FPGA8B (R1E.2 U1E#8.AB10 U1E#8.AC10)
IL68.VIOTB_FPGA32: FPGA32 (C31F.2 C32F.2 R4F.2 U6F.13), FPGA32/FPGA8B (R1F.2 U1F#8.AB10 U1F#8.AC10)
IL68.VIOTB_FPGA33: FPGA33 (C31G.2 C32G.2 R4G.2 U6G.13), FPGA33/FPGA8B (R1G.2 U1G#8.AB10 U1G#8.AC10)
IMIB135.S0: FPGA01/FPGA0B (U1A#1.A10), FPGA02/FPGA0B (U1B#1.A10), FPGA03/FPGA0B (U1C#1.A10), FPGA20/FPGA0B (U1L#1.A10), FPGA21/FPGA0B (U1M#1.A10), FPGA22/FPGA0B (U1N#1.A10), FPGA23/FPGA0B (U1O#1.A10)
IMIB135.S1: FPGA01/FPGA0B (U1A#1.B10), FPGA02/FPGA0B (U1B#1.B10), FPGA03/FPGA0B (U1C#1.B10), FPGA20/FPGA0B (U1L#1.B10), FPGA21/FPGA0B (U1M#1.B10), FPGA22/FPGA0B (U1N#1.B10), FPGA23/FPGA0B (U1O#1.B10)
IMIB135.S2: FPGA01/FPGA0B (U1A#1.E11), FPGA02/FPGA0B (U1B#1.E11), FPGA03/FPGA0B (U1C#1.E11), FPGA20/FPGA0B (U1L#1.E11), FPGA21/FPGA0B (U1M#1.E11), FPGA22/FPGA0B (U1N#1.E11), FPGA23/FPGA0B (U1O#1.E11)
IMIB135.S3: FPGA01/FPGA0B (U1A#1.F11), FPGA02/FPGA0B (U1B#1.F11), FPGA03/FPGA0B (U1C#1.F11), FPGA20/FPGA0B (U1L#1.F11), FPGA21/FPGA0B (U1M#1.F11), FPGA22/FPGA0B (U1N#1.F11), FPGA23/FPGA0B (U1O#1.F11)
IMIB135.S4: FPGA01/FPGA0B (U1A#1.E10), FPGA02/FPGA0B (U1B#1.E10), FPGA03/FPGA0B (U1C#1.E10), FPGA20/FPGA0B (U1L#1.E10), FPGA21/FPGA0B (U1M#1.E10), FPGA22/FPGA0B (U1N#1.E10), FPGA23/FPGA0B (U1O#1.E10)
IMIB135.S5: FPGA01/FPGA0B (U1A#1.F10), FPGA02/FPGA0B (U1B#1.F10), FPGA03/FPGA0B (U1C#1.F10), FPGA20/FPGA0B (U1L#1.F10), FPGA21/FPGA0B (U1M#1.F10), FPGA22/FPGA0B (U1N#1.F10), FPGA23/FPGA0B (U1O#1.F10)
IMIB135.S6: FPGA01/FPGA0B (U1A#1.A11), FPGA02/FPGA0B (U1B#1.A11), FPGA03/FPGA0B (U1C#1.A11), FPGA20/FPGA0B (U1L#1.A11), FPGA21/FPGA0B (U1M#1.A11), FPGA22/FPGA0B (U1N#1.A11), FPGA23/FPGA0B (U1O#1.A11)
IMIB135.S7: FPGA01/FPGA0B (U1A#1.B11), FPGA02/FPGA0B (U1B#1.B11), FPGA03/FPGA0B (U1C#1.B11), FPGA20/FPGA0B (U1L#1.B11), FPGA21/FPGA0B (U1M#1.B11), FPGA22/FPGA0B (U1N#1.B11), FPGA23/FPGA0B (U1O#1.B11)
IMIB135.S8: FPGA01/FPGA0B (U1A#1.D13), FPGA02/FPGA0B (U1B#1.D13), FPGA03/FPGA0B (U1C#1.D13), FPGA20/FPGA0B (U1L#1.D13), FPGA21/FPGA0B (U1M#1.D13), FPGA22/FPGA0B (U1N#1.D13), FPGA23/FPGA0B (U1O#1.D13)
IMIB135.S9: FPGA01/FPGA0B (U1A#1.F13), FPGA02/FPGA0B (U1B#1.F13), FPGA03/FPGA0B (U1C#1.F13), FPGA20/FPGA0B (U1L#1.F13), FPGA21/FPGA0B (U1M#1.F13), FPGA22/FPGA0B (U1N#1.F13), FPGA23/FPGA0B (U1O#1.F13)
IMIB135.S10: FPGA01/FPGA0B (U1A#1.A13), FPGA02/FPGA0B (U1B#1.A13), FPGA03/FPGA0B (U1C#1.A13), FPGA20/FPGA0B (U1L#1.A13), FPGA21/FPGA0B (U1M#1.A13), FPGA22/FPGA0B (U1N#1.A13), FPGA23/FPGA0B (U1O#1.A13)
IMIB135.S11: FPGA01/FPGA0B (U1A#1.C13), FPGA02/FPGA0B (U1B#1.C13), FPGA03/FPGA0B (U1C#1.C13), FPGA20/FPGA0B (U1L#1.C13), FPGA21/FPGA0B (U1M#1.C13), FPGA22/FPGA0B (U1N#1.C13), FPGA23/FPGA0B (U1O#1.C13)
IMIB135.S12: FPGA01/FPGA0B (U1A#1.E14), FPGA02/FPGA0B (U1B#1.E14), FPGA03/FPGA0B (U1C#1.E14), FPGA20/FPGA0B (U1L#1.E14), FPGA21/FPGA0B (U1M#1.E14), FPGA22/FPGA0B (U1N#1.E14), FPGA23/FPGA0B (U1O#1.E14)
IMIB135.S13: FPGA01/FPGA0B (U1A#1.F14), FPGA02/FPGA0B (U1B#1.F14), FPGA03/FPGA0B (U1C#1.F14), FPGA20/FPGA0B (U1L#1.F14), FPGA21/FPGA0B (U1M#1.F14), FPGA22/FPGA0B (U1N#1.F14), FPGA23/FPGA0B (U1O#1.F14)
IMIB135.S14: FPGA01/FPGA0B (U1A#1.C14), FPGA02/FPGA0B (U1B#1.C14), FPGA03/FPGA0B (U1C#1.C14), FPGA20/FPGA0B (U1L#1.C14), FPGA21/FPGA0B (U1M#1.C14), FPGA22/FPGA0B (U1N#1.C14), FPGA23/FPGA0B (U1O#1.C14)
IMIB135.S15: FPGA01/FPGA0B (U1A#1.D14), FPGA02/FPGA0B (U1B#1.D14), FPGA03/FPGA0B (U1C#1.D14), FPGA20/FPGA0B (U1L#1.D14), FPGA21/FPGA0B (U1M#1.D14), FPGA22/FPGA0B (U1N#1.D14), FPGA23/FPGA0B (U1O#1.D14)
IMIB135.S16: FPGA01/FPGA0B (U1A#1.A14), FPGA02/FPGA0B (U1B#1.A14), FPGA03/FPGA0B (U1C#1.A14), FPGA20/FPGA0B (U1L#1.A14), FPGA21/FPGA0B (U1M#1.A14), FPGA22/FPGA0B (U1N#1.A14), FPGA23/FPGA0B (U1O#1.A14)
IMIB135.S17: FPGA01/FPGA0B (U1A#1.B14), FPGA02/FPGA0B (U1B#1.B14), FPGA03/FPGA0B (U1C#1.B14), FPGA20/FPGA0B (U1L#1.B14), FPGA21/FPGA0B (U1M#1.B14), FPGA22/FPGA0B (U1N#1.B14), FPGA23/FPGA0B (U1O#1.B14)
IMIB135.S18: FPGA01/FPGA0B (U1A#1.D15), FPGA02/FPGA0B (U1B#1.D15), FPGA03/FPGA0B (U1C#1.D15), FPGA20/FPGA0B (U1L#1.D15), FPGA21/FPGA0B (U1M#1.D15), FPGA22/FPGA0B (U1N#1.D15), FPGA23/FPGA0B (U1O#1.D15)
IMIB135.S19: FPGA01/FPGA0B (U1A#1.F15), FPGA02/FPGA0B (U1B#1.F15), FPGA03/FPGA0B (U1C#1.F15), FPGA20/FPGA0B (U1L#1.F15), FPGA21/FPGA0B (U1M#1.F15), FPGA22/FPGA0B (U1N#1.F15), FPGA23/FPGA0B (U1O#1.F15)
IMIB135.S20: FPGA01/FPGA0B (U1A#1.A15), FPGA02/FPGA0B (U1B#1.A15), FPGA03/FPGA0B (U1C#1.A15), FPGA20/FPGA0B (U1L#1.A15), FPGA21/FPGA0B (U1M#1.A15), FPGA22/FPGA0B (U1N#1.A15), FPGA23/FPGA0B (U1O#1.A15)
IMIB135.S21: FPGA01/FPGA0B (U1A#1.C15), FPGA02/FPGA0B (U1B#1.C15), FPGA03/FPGA0B (U1C#1.C15), FPGA20/FPGA0B (U1L#1.C15), FPGA21/FPGA0B (U1M#1.C15), FPGA22/FPGA0B (U1N#1.C15), FPGA23/FPGA0B (U1O#1.C15)
IMIB135.S22: FPGA01/FPGA0B (U1A#1.E16), FPGA02/FPGA0B (U1B#1.E16), FPGA03/FPGA0B (U1C#1.E16), FPGA20/FPGA0B (U1L#1.E16), FPGA21/FPGA0B (U1M#1.E16), FPGA22/FPGA0B (U1N#1.E16), FPGA23/FPGA0B (U1O#1.E16)
IMIB135.S23: FPGA01/FPGA0B (U1A#1.F16), FPGA02/FPGA0B (U1B#1.F16), FPGA03/FPGA0B (U1C#1.F16), FPGA20/FPGA0B (U1L#1.F16), FPGA21/FPGA0B (U1M#1.F16), FPGA22/FPGA0B (U1N#1.F16), FPGA23/FPGA0B (U1O#1.F16)
IMIB135.S24: FPGA01/FPGA0B (U1A#1.C16), FPGA02/FPGA0B (U1B#1.C16), FPGA03/FPGA0B (U1C#1.C16), FPGA20/FPGA0B (U1L#1.C16), FPGA21/FPGA0B (U1M#1.C16), FPGA22/FPGA0B (U1N#1.C16), FPGA23/FPGA0B (U1O#1.C16)
IMIB135.S25: FPGA01/FPGA0B (U1A#1.D16), FPGA02/FPGA0B (U1B#1.D16), FPGA03/FPGA0B (U1C#1.D16), FPGA20/FPGA0B (U1L#1.D16), FPGA21/FPGA0B (U1M#1.D16), FPGA22/FPGA0B (U1N#1.D16), FPGA23/FPGA0B (U1O#1.D16)
IMIB135.S26: FPGA01/FPGA0B (U1A#1.A16), FPGA02/FPGA0B (U1B#1.A16), FPGA03/FPGA0B (U1C#1.A16), FPGA20/FPGA0B (U1L#1.A16), FPGA21/FPGA0B (U1M#1.A16), FPGA22/FPGA0B (U1N#1.A16), FPGA23/FPGA0B (U1O#1.A16)
IMIB135.S27: FPGA01/FPGA0B (U1A#1.B16), FPGA02/FPGA0B (U1B#1.B16), FPGA03/FPGA0B (U1C#1.B16), FPGA20/FPGA0B (U1L#1.B16), FPGA21/FPGA0B (U1M#1.B16), FPGA22/FPGA0B (U1N#1.B16), FPGA23/FPGA0B (U1O#1.B16)
IMIB135.S28: FPGA01/FPGA0B (U1A#1.B17), FPGA02/FPGA0B (U1B#1.B17), FPGA03/FPGA0B (U1C#1.B17), FPGA20/FPGA0B (U1L#1.B17), FPGA21/FPGA0B (U1M#1.B17), FPGA22/FPGA0B (U1N#1.B17), FPGA23/FPGA0B (U1O#1.B17)
IMIB135.S29: FPGA01/FPGA0B (U1A#1.A17), FPGA02/FPGA0B (U1B#1.A17), FPGA03/FPGA0B (U1C#1.A17), FPGA20/FPGA0B (U1L#1.A17), FPGA21/FPGA0B (U1M#1.A17), FPGA22/FPGA0B (U1N#1.A17), FPGA23/FPGA0B (U1O#1.A17)
MIB135.S0: FPGA30/FPGA0B (U1D#1.A10), FPGA31/FPGA0B (U1E#1.A10), FPGA32/FPGA0B (U1F#1.A10), FPGA33/FPGA0B (U1G#1.A10), FPGA10/FPGA0B (U1H#1.A10), FPGA11/FPGA0B (U1I#1.A10), FPGA12/FPGA0B (U1J#1.A10), FPGA13/FPGA0B (U1K#1.A10)
MIB135.S1: FPGA30/FPGA0B (U1D#1.B10), FPGA31/FPGA0B (U1E#1.B10), FPGA32/FPGA0B (U1F#1.B10), FPGA33/FPGA0B (U1G#1.B10), FPGA10/FPGA0B (U1H#1.B10), FPGA11/FPGA0B (U1I#1.B10), FPGA12/FPGA0B (U1J#1.B10), FPGA13/FPGA0B (U1K#1.B10)
MIB135.S2: FPGA30/FPGA0B (U1D#1.E11), FPGA31/FPGA0B (U1E#1.E11), FPGA32/FPGA0B (U1F#1.E11), FPGA33/FPGA0B (U1G#1.E11), FPGA10/FPGA0B (U1H#1.E11), FPGA11/FPGA0B (U1I#1.E11), FPGA12/FPGA0B (U1J#1.E11), FPGA13/FPGA0B (U1K#1.E11)
MIB135.S3: FPGA30/FPGA0B (U1D#1.F11), FPGA31/FPGA0B (U1E#1.F11), FPGA32/FPGA0B (U1F#1.F11), FPGA33/FPGA0B (U1G#1.F11), FPGA10/FPGA0B (U1H#1.F11), FPGA11/FPGA0B (U1I#1.F11), FPGA12/FPGA0B (U1J#1.F11), FPGA13/FPGA0B (U1K#1.F11)
MIB135.S4: FPGA30/FPGA0B (U1D#1.E10), FPGA31/FPGA0B (U1E#1.E10), FPGA32/FPGA0B (U1F#1.E10), FPGA33/FPGA0B (U1G#1.E10), FPGA10/FPGA0B (U1H#1.E10), FPGA11/FPGA0B (U1I#1.E10), FPGA12/FPGA0B (U1J#1.E10), FPGA13/FPGA0B (U1K#1.E10)
MIB135.S5: FPGA30/FPGA0B (U1D#1.F10), FPGA31/FPGA0B (U1E#1.F10), FPGA32/FPGA0B (U1F#1.F10), FPGA33/FPGA0B (U1G#1.F10), FPGA10/FPGA0B (U1H#1.F10), FPGA11/FPGA0B (U1I#1.F10), FPGA12/FPGA0B (U1J#1.F10), FPGA13/FPGA0B (U1K#1.F10)
MIB135.S6: FPGA30/FPGA0B (U1D#1.A11), FPGA31/FPGA0B (U1E#1.A11), FPGA32/FPGA0B (U1F#1.A11), FPGA33/FPGA0B (U1G#1.A11), FPGA10/FPGA0B (U1H#1.A11), FPGA11/FPGA0B (U1I#1.A11), FPGA12/FPGA0B (U1J#1.A11), FPGA13/FPGA0B (U1K#1.A11)
MIB135.S7: FPGA30/FPGA0B (U1D#1.B11), FPGA31/FPGA0B (U1E#1.B11), FPGA32/FPGA0B (U1F#1.B11), FPGA33/FPGA0B (U1G#1.B11), FPGA10/FPGA0B (U1H#1.B11), FPGA11/FPGA0B (U1I#1.B11), FPGA12/FPGA0B (U1J#1.B11), FPGA13/FPGA0B (U1K#1.B11)
MIB135.S8: FPGA30/FPGA0B (U1D#1.D13), FPGA31/FPGA0B (U1E#1.D13), FPGA32/FPGA0B (U1F#1.D13), FPGA33/FPGA0B (U1G#1.D13), FPGA10/FPGA0B (U1H#1.D13), FPGA11/FPGA0B (U1I#1.D13), FPGA12/FPGA0B (U1J#1.D13), FPGA13/FPGA0B (U1K#1.D13)
MIB135.S9: FPGA30/FPGA0B (U1D#1.F13), FPGA31/FPGA0B (U1E#1.F13), FPGA32/FPGA0B (U1F#1.F13), FPGA33/FPGA0B (U1G#1.F13), FPGA10/FPGA0B (U1H#1.F13), FPGA11/FPGA0B (U1I#1.F13), FPGA12/FPGA0B (U1J#1.F13), FPGA13/FPGA0B (U1K#1.F13)
MIB135.S10: FPGA30/FPGA0B (U1D#1.A13), FPGA31/FPGA0B (U1E#1.A13), FPGA32/FPGA0B (U1F#1.A13), FPGA33/FPGA0B (U1G#1.A13), FPGA10/FPGA0B (U1H#1.A13), FPGA11/FPGA0B (U1I#1.A13), FPGA12/FPGA0B (U1J#1.A13), FPGA13/FPGA0B (U1K#1.A13)
MIB135.S11: FPGA30/FPGA0B (U1D#1.C13), FPGA31/FPGA0B (U1E#1.C13), FPGA32/FPGA0B (U1F#1.C13), FPGA33/FPGA0B (U1G#1.C13), FPGA10/FPGA0B (U1H#1.C13), FPGA11/FPGA0B (U1I#1.C13), FPGA12/FPGA0B (U1J#1.C13), FPGA13/FPGA0B (U1K#1.C13)
MIB135.S12: FPGA30/FPGA0B (U1D#1.E14), FPGA31/FPGA0B (U1E#1.E14), FPGA32/FPGA0B (U1F#1.E14), FPGA33/FPGA0B (U1G#1.E14), FPGA10/FPGA0B (U1H#1.E14), FPGA11/FPGA0B (U1I#1.E14), FPGA12/FPGA0B (U1J#1.E14), FPGA13/FPGA0B (U1K#1.E14)
MIB135.S13: FPGA30/FPGA0B (U1D#1.F14), FPGA31/FPGA0B (U1E#1.F14), FPGA32/FPGA0B (U1F#1.F14), FPGA33/FPGA0B (U1G#1.F14), FPGA10/FPGA0B (U1H#1.F14), FPGA11/FPGA0B (U1I#1.F14), FPGA12/FPGA0B (U1J#1.F14), FPGA13/FPGA0B (U1K#1.F14)
MIB135.S14: FPGA30/FPGA0B (U1D#1.C14), FPGA31/FPGA0B (U1E#1.C14), FPGA32/FPGA0B (U1F#1.C14), FPGA33/FPGA0B (U1G#1.C14), FPGA10/FPGA0B (U1H#1.C14), FPGA11/FPGA0B (U1I#1.C14), FPGA12/FPGA0B (U1J#1.C14), FPGA13/FPGA0B (U1K#1.C14)
MIB135.S15: FPGA30/FPGA0B (U1D#1.D14), FPGA31/FPGA0B (U1E#1.D14), FPGA32/FPGA0B (U1F#1.D14), FPGA33/FPGA0B (U1G#1.D14), FPGA10/FPGA0B (U1H#1.D14), FPGA11/FPGA0B (U1I#1.D14), FPGA12/FPGA0B (U1J#1.D14), FPGA13/FPGA0B (U1K#1.D14)
MIB135.S16: FPGA30/FPGA0B (U1D#1.A14), FPGA31/FPGA0B (U1E#1.A14), FPGA32/FPGA0B (U1F#1.A14), FPGA33/FPGA0B (U1G#1.A14), FPGA10/FPGA0B (U1H#1.A14), FPGA11/FPGA0B (U1I#1.A14), FPGA12/FPGA0B (U1J#1.A14), FPGA13/FPGA0B (U1K#1.A14)
MIB135.S17: FPGA30/FPGA0B (U1D#1.B14), FPGA31/FPGA0B (U1E#1.B14), FPGA32/FPGA0B (U1F#1.B14), FPGA33/FPGA0B (U1G#1.B14), FPGA10/FPGA0B (U1H#1.B14), FPGA11/FPGA0B (U1I#1.B14), FPGA12/FPGA0B (U1J#1.B14), FPGA13/FPGA0B (U1K#1.B14)
MIB135.S18: FPGA30/FPGA0B (U1D#1.D15), FPGA31/FPGA0B (U1E#1.D15), FPGA32/FPGA0B (U1F#1.D15), FPGA33/FPGA0B (U1G#1.D15), FPGA10/FPGA0B (U1H#1.D15), FPGA11/FPGA0B (U1I#1.D15), FPGA12/FPGA0B (U1J#1.D15), FPGA13/FPGA0B (U1K#1.D15)
MIB135.S19: FPGA30/FPGA0B (U1D#1.F15), FPGA31/FPGA0B (U1E#1.F15), FPGA32/FPGA0B (U1F#1.F15), FPGA33/FPGA0B (U1G#1.F15), FPGA10/FPGA0B (U1H#1.F15), FPGA11/FPGA0B (U1I#1.F15), FPGA12/FPGA0B (U1J#1.F15), FPGA13/FPGA0B (U1K#1.F15)
MIB135.S20: FPGA30/FPGA0B (U1D#1.A15), FPGA31/FPGA0B (U1E#1.A15), FPGA32/FPGA0B (U1F#1.A15), FPGA33/FPGA0B (U1G#1.A15), FPGA10/FPGA0B (U1H#1.A15), FPGA11/FPGA0B (U1I#1.A15), FPGA12/FPGA0B (U1J#1.A15), FPGA13/FPGA0B (U1K#1.A15)
MIB135.S21: FPGA30/FPGA0B (U1D#1.C15), FPGA31/FPGA0B (U1E#1.C15), FPGA32/FPGA0B (U1F#1.C15), FPGA33/FPGA0B (U1G#1.C15), FPGA10/FPGA0B (U1H#1.C15), FPGA11/FPGA0B (U1I#1.C15), FPGA12/FPGA0B (U1J#1.C15), FPGA13/FPGA0B (U1K#1.C15)
MIB135.S22: FPGA30/FPGA0B (U1D#1.E16), FPGA31/FPGA0B (U1E#1.E16), FPGA32/FPGA0B (U1F#1.E16), FPGA33/FPGA0B (U1G#1.E16), FPGA10/FPGA0B (U1H#1.E16), FPGA11/FPGA0B (U1I#1.E16), FPGA12/FPGA0B (U1J#1.E16), FPGA13/FPGA0B (U1K#1.E16)
MIB135.S23: FPGA30/FPGA0B (U1D#1.F16), FPGA31/FPGA0B (U1E#1.F16), FPGA32/FPGA0B (U1F#1.F16), FPGA33/FPGA0B (U1G#1.F16), FPGA10/FPGA0B (U1H#1.F16), FPGA11/FPGA0B (U1I#1.F16), FPGA12/FPGA0B (U1J#1.F16), FPGA13/FPGA0B (U1K#1.F16)
MIB135.S24: FPGA30/FPGA0B (U1D#1.C16), FPGA31/FPGA0B (U1E#1.C16), FPGA32/FPGA0B (U1F#1.C16), FPGA33/FPGA0B (U1G#1.C16), FPGA10/FPGA0B (U1H#1.C16), FPGA11/FPGA0B (U1I#1.C16), FPGA12/FPGA0B (U1J#1.C16), FPGA13/FPGA0B (U1K#1.C16)
MIB135.S25: FPGA30/FPGA0B (U1D#1.D16), FPGA31/FPGA0B (U1E#1.D16), FPGA32/FPGA0B (U1F#1.D16), FPGA33/FPGA0B (U1G#1.D16), FPGA10/FPGA0B (U1H#1.D16), FPGA11/FPGA0B (U1I#1.D16), FPGA12/FPGA0B (U1J#1.D16), FPGA13/FPGA0B (U1K#1.D16)
MIB135.S26: FPGA30/FPGA0B (U1D#1.A16), FPGA31/FPGA0B (U1E#1.A16), FPGA32/FPGA0B (U1F#1.A16), FPGA33/FPGA0B (U1G#1.A16), FPGA10/FPGA0B (U1H#1.A16), FPGA11/FPGA0B (U1I#1.A16), FPGA12/FPGA0B (U1J#1.A16), FPGA13/FPGA0B (U1K#1.A16)
MIB135.S27: FPGA30/FPGA0B (U1D#1.B16), FPGA31/FPGA0B (U1E#1.B16), FPGA32/FPGA0B (U1F#1.B16), FPGA33/FPGA0B (U1G#1.B16), FPGA10/FPGA0B (U1H#1.B16), FPGA11/FPGA0B (U1I#1.B16), FPGA12/FPGA0B (U1J#1.B16), FPGA13/FPGA0B (U1K#1.B16)
MIB135.S28: FPGA30/FPGA0B (U1D#1.B17), FPGA31/FPGA0B (U1E#1.B17), FPGA32/FPGA0B (U1F#1.B17), FPGA33/FPGA0B (U1G#1.B17), FPGA10/FPGA0B (U1H#1.B17), FPGA11/FPGA0B (U1I#1.B17), FPGA12/FPGA0B (U1J#1.B17), FPGA13/FPGA0B (U1K#1.B17)
MIB135.S29: FPGA30/FPGA0B (U1D#1.A17), FPGA31/FPGA0B (U1E#1.A17), FPGA32/FPGA0B (U1F#1.A17), FPGA33/FPGA0B (U1G#1.A17), FPGA10/FPGA0B (U1H#1.A17), FPGA11/FPGA0B (U1I#1.A17), FPGA12/FPGA0B (U1J#1.A17), FPGA13/FPGA0B (U1K#1.A17)